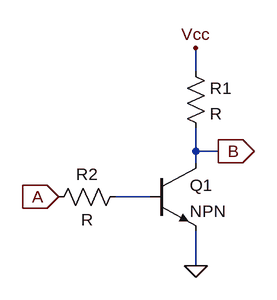
[diagram p0: schematic NOT.asc]
NOT.asc, the LTspice schematic file:
Version 4
SHEET 1 880 680
WIRE 256 16 256 -16
WIRE 256 128 256 96
WIRE 288 128 256 128
WIRE 256 144 256 128
WIRE 192 192 144 192
WIRE 256 288 256 240
FLAG 256 288 0
FLAG 64 192 A
IOPIN 64 192 In
FLAG 288 128 B
IOPIN 288 128 Out
FLAG 256 -16 Vcc
SYMBOL npn 192 144 R0
SYMATTR InstName Q1
SYMBOL res 240 0 R0
SYMATTR InstName R1
SYMBOL res 160 176 R90
WINDOW 0 0 56 VBottom 2
WINDOW 3 32 56 VTop 2
SYMATTR InstName R2

The netlist it stands for:
* NOT.asc
Q1 B N001 0 0 NPN
R1 Vcc B R
R2 N001 A R
.model NPN NPN
.model PNP PNP
.lib standard.bjt
.backanno
.end